# EAGLE schematic raspberry_hat (EAGLE 7.5.0)
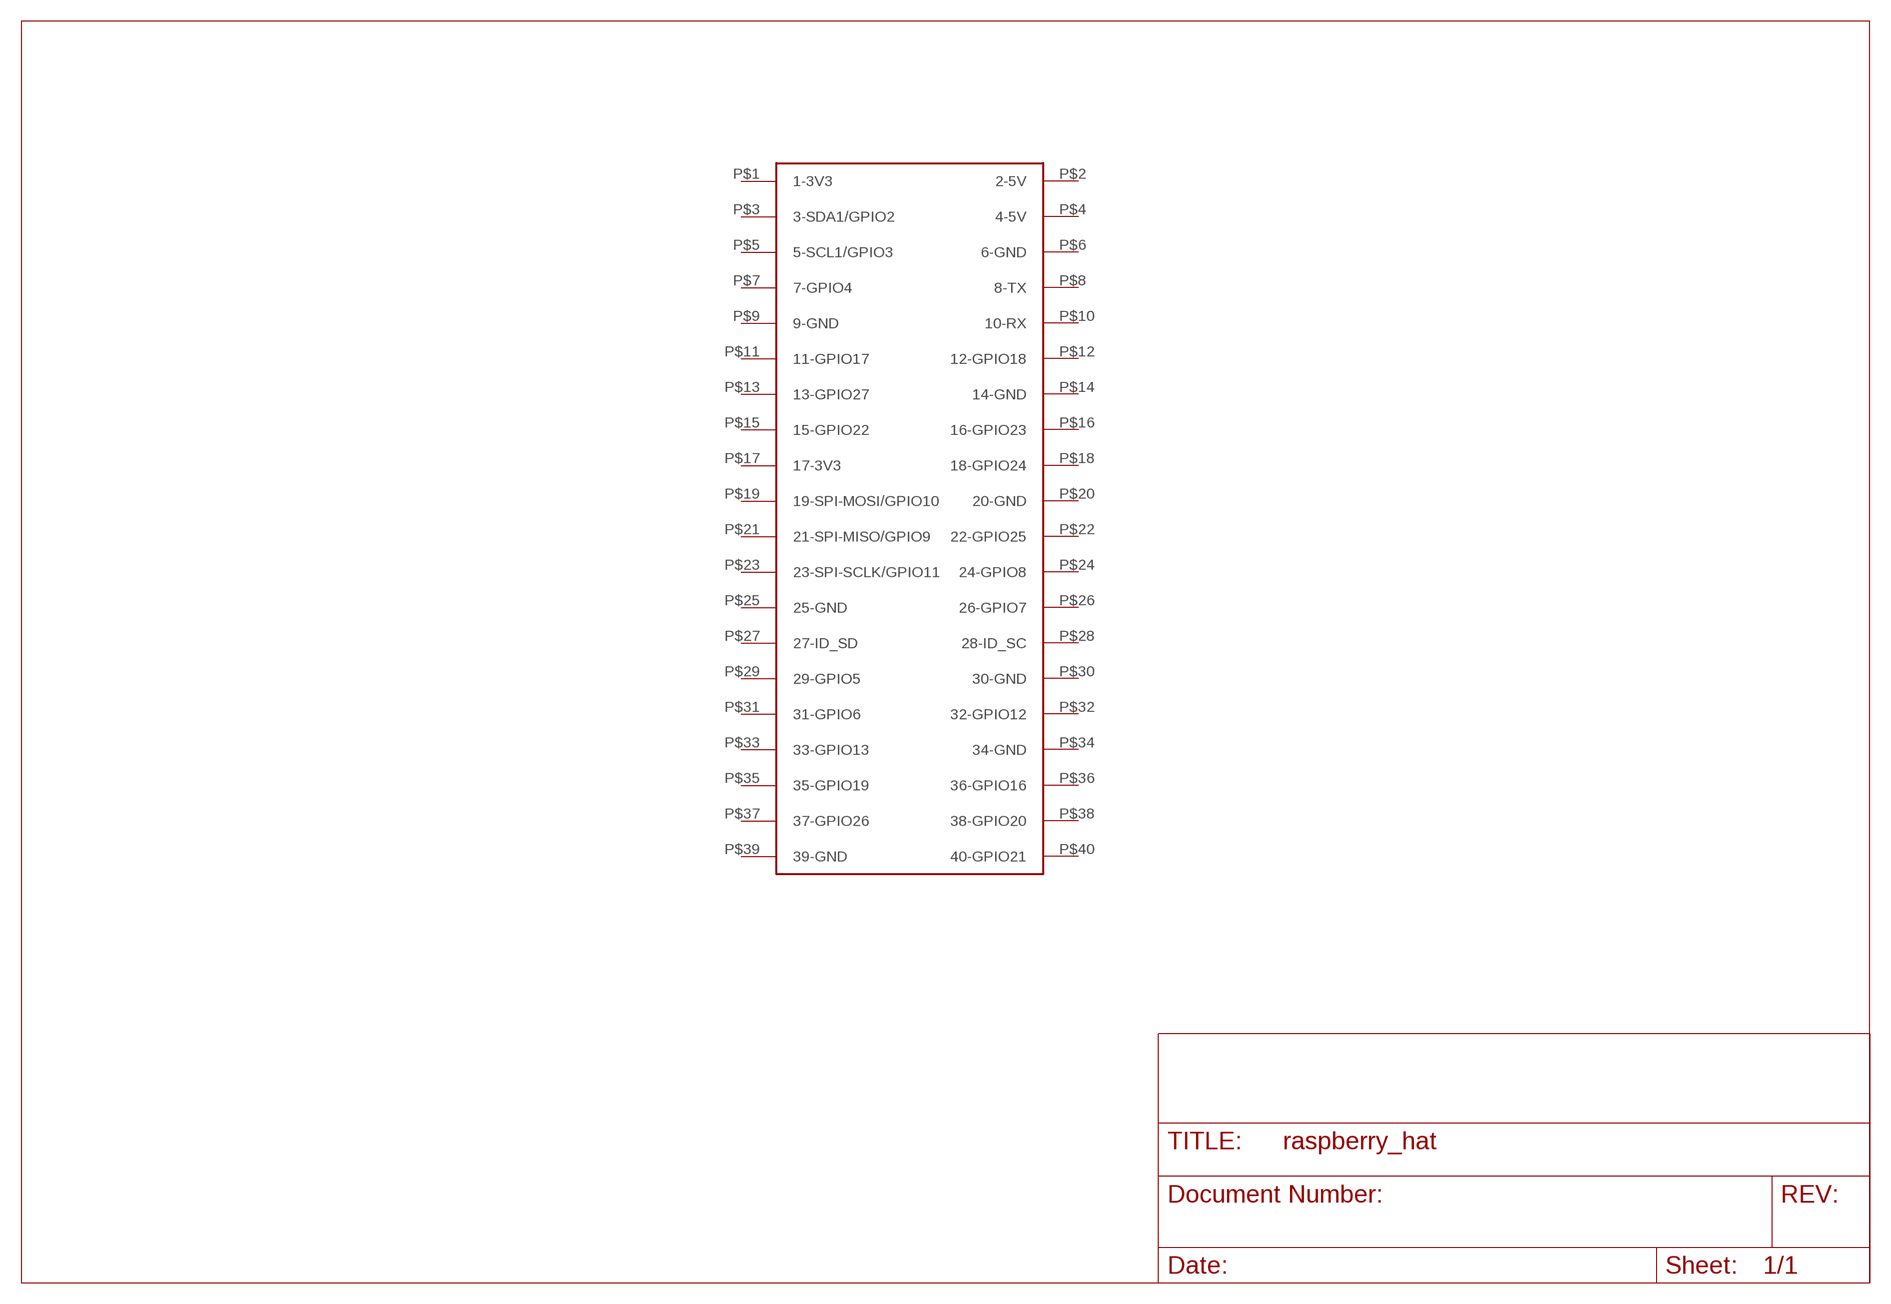
[diagram p0: schematic, sheet 1]

## Parts
U$1  RASPBERRY-PI+CAM/DISPLAY_NOTCH  [RASPBERRY-PI-PLUS-DISPLAY/CAM_NOTCH]
Unconnected: U$1.P$1(1-3V3) U$1.P$2(2-5V) U$1.P$3(3-SDA1/GPIO2) U$1.P$4(4-5V) U$1.P$5(5-SCL1/GPIO3) U$1.P$6(6-GND) U$1.P$7(7-GPIO4) U$1.P$8(8-TX) U$1.P$9(9-GND) U$1.P$10(10-RX) U$1.P$11(11-GPIO17) U$1.P$12(12-GPIO18) U$1.P$13(13-GPIO27) U$1.P$14(14-GND) U$1.P$15(15-GPIO22) U$1.P$16(16-GPIO23) U$1.P$17(17-3V3) U$1.P$18(18-GPIO24) U$1.P$19(19-SPI-MOSI/GPIO10) U$1.P$20(20-GND) U$1.P$21(21-SPI-MISO/GPIO9) U$1.P$22(22-GPIO25) U$1.P$23(23-SPI-SCLK/GPIO11) U$1.P$24(24-GPIO8) U$1.P$25(25-GND) U$1.P$26(26-GPIO7) U$1.P$27(27-ID_SD) U$1.P$28(28-ID_SC) U$1.P$29(29-GPIO5) U$1.P$30(30-GND) U$1.P$31(31-GPIO6) U$1.P$32(32-GPIO12) U$1.P$33(33-GPIO13) U$1.P$34(34-GND) U$1.P$35(35-GPIO19) U$1.P$36(36-GPIO16) U$1.P$37(37-GPIO26) U$1.P$38(38-GPIO20) U$1.P$39(39-GND) U$1.P$40(40-GPIO21)

## Library data of the parts
U$1 = Ava:RASPBERRY-PI+: Samtec SSW-120-01-T-D